# Altium schematic sheet Flags.SchDoc
size A; Author: E. Sims; Organization: Let's Build Rockets Inc.; SheetNumber: 11; SheetTotal: 11
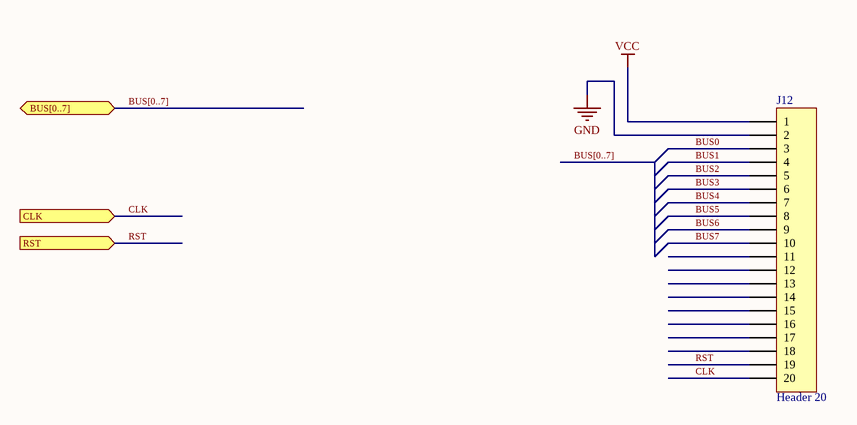
[diagram p0: Flags.SchDoc]

## Parts
J12  Header 20  [HDR1X20]

## Ports
BUS[0..7] (bidir), CLK (in), RST (in)

## Nets
GND: J12.2
VCC: J12.1
BUS0: J12.3
BUS1: J12.4
BUS2: J12.5
BUS3: J12.6
BUS4: J12.7
BUS5: J12.8
BUS6: J12.9
BUS7: J12.10
CLK: J12.20 ; port CLK
RST: J12.19 ; port RST

Not connected (* = marked no-connect by the designer): J12 11 12 13 14 15 16 17 18

## Buses and harness runs
bus BUS[0..7]
bus BUS[0..7] = port BUS[0..7]

## Notes on the sheet
- Let's Build Rocket's Inc. Modular Paylaod System Based on TMP-010 Rev
  For more information visit https://github.com/LetsBuildRockets/Modular-Payload-System
  This work is licensed under CC BY-NC 4.0. To view a copy of this license, visit https://creativecommons.org/licenses/by-nc/4.0
- Title
- Size:
- Date:
- Assembly Variant:
- B
- Number:
- Time:
- Revision:
- Sheet
- of
- Author:
- File:

## Library data of the parts
J12 = Header 20: Header, 20-Pin; System: Connector; LatestRevisionDate: 17-Jul-2002; LatestRevisionNote: Re-released for DXP Platform.; Publisher: Altium Limited